# Altium schematic sheet FU6561N-XCQ-DEMO_V1.0-20251116.SCHDOC: ?
size A3; SheetNumber: 1; SheetTotal: 1; PageSetup: Record=PageOptions|CenterHorizontal=True|CenterVertical=True|PrintScale=0.81|XCorrection=1.00|YCorrection=1.00|PrintKind=0|BorderSize=5000000|LeftOffset=0|BottomOffset=0|Orientation=2|PaperLength=1000|PaperWidth=1000|Scale=100|PaperSource=7|PrintQuality=-4|MediaType=1|DitherType=10|PaperKind=A4|PrintScaleMode=1
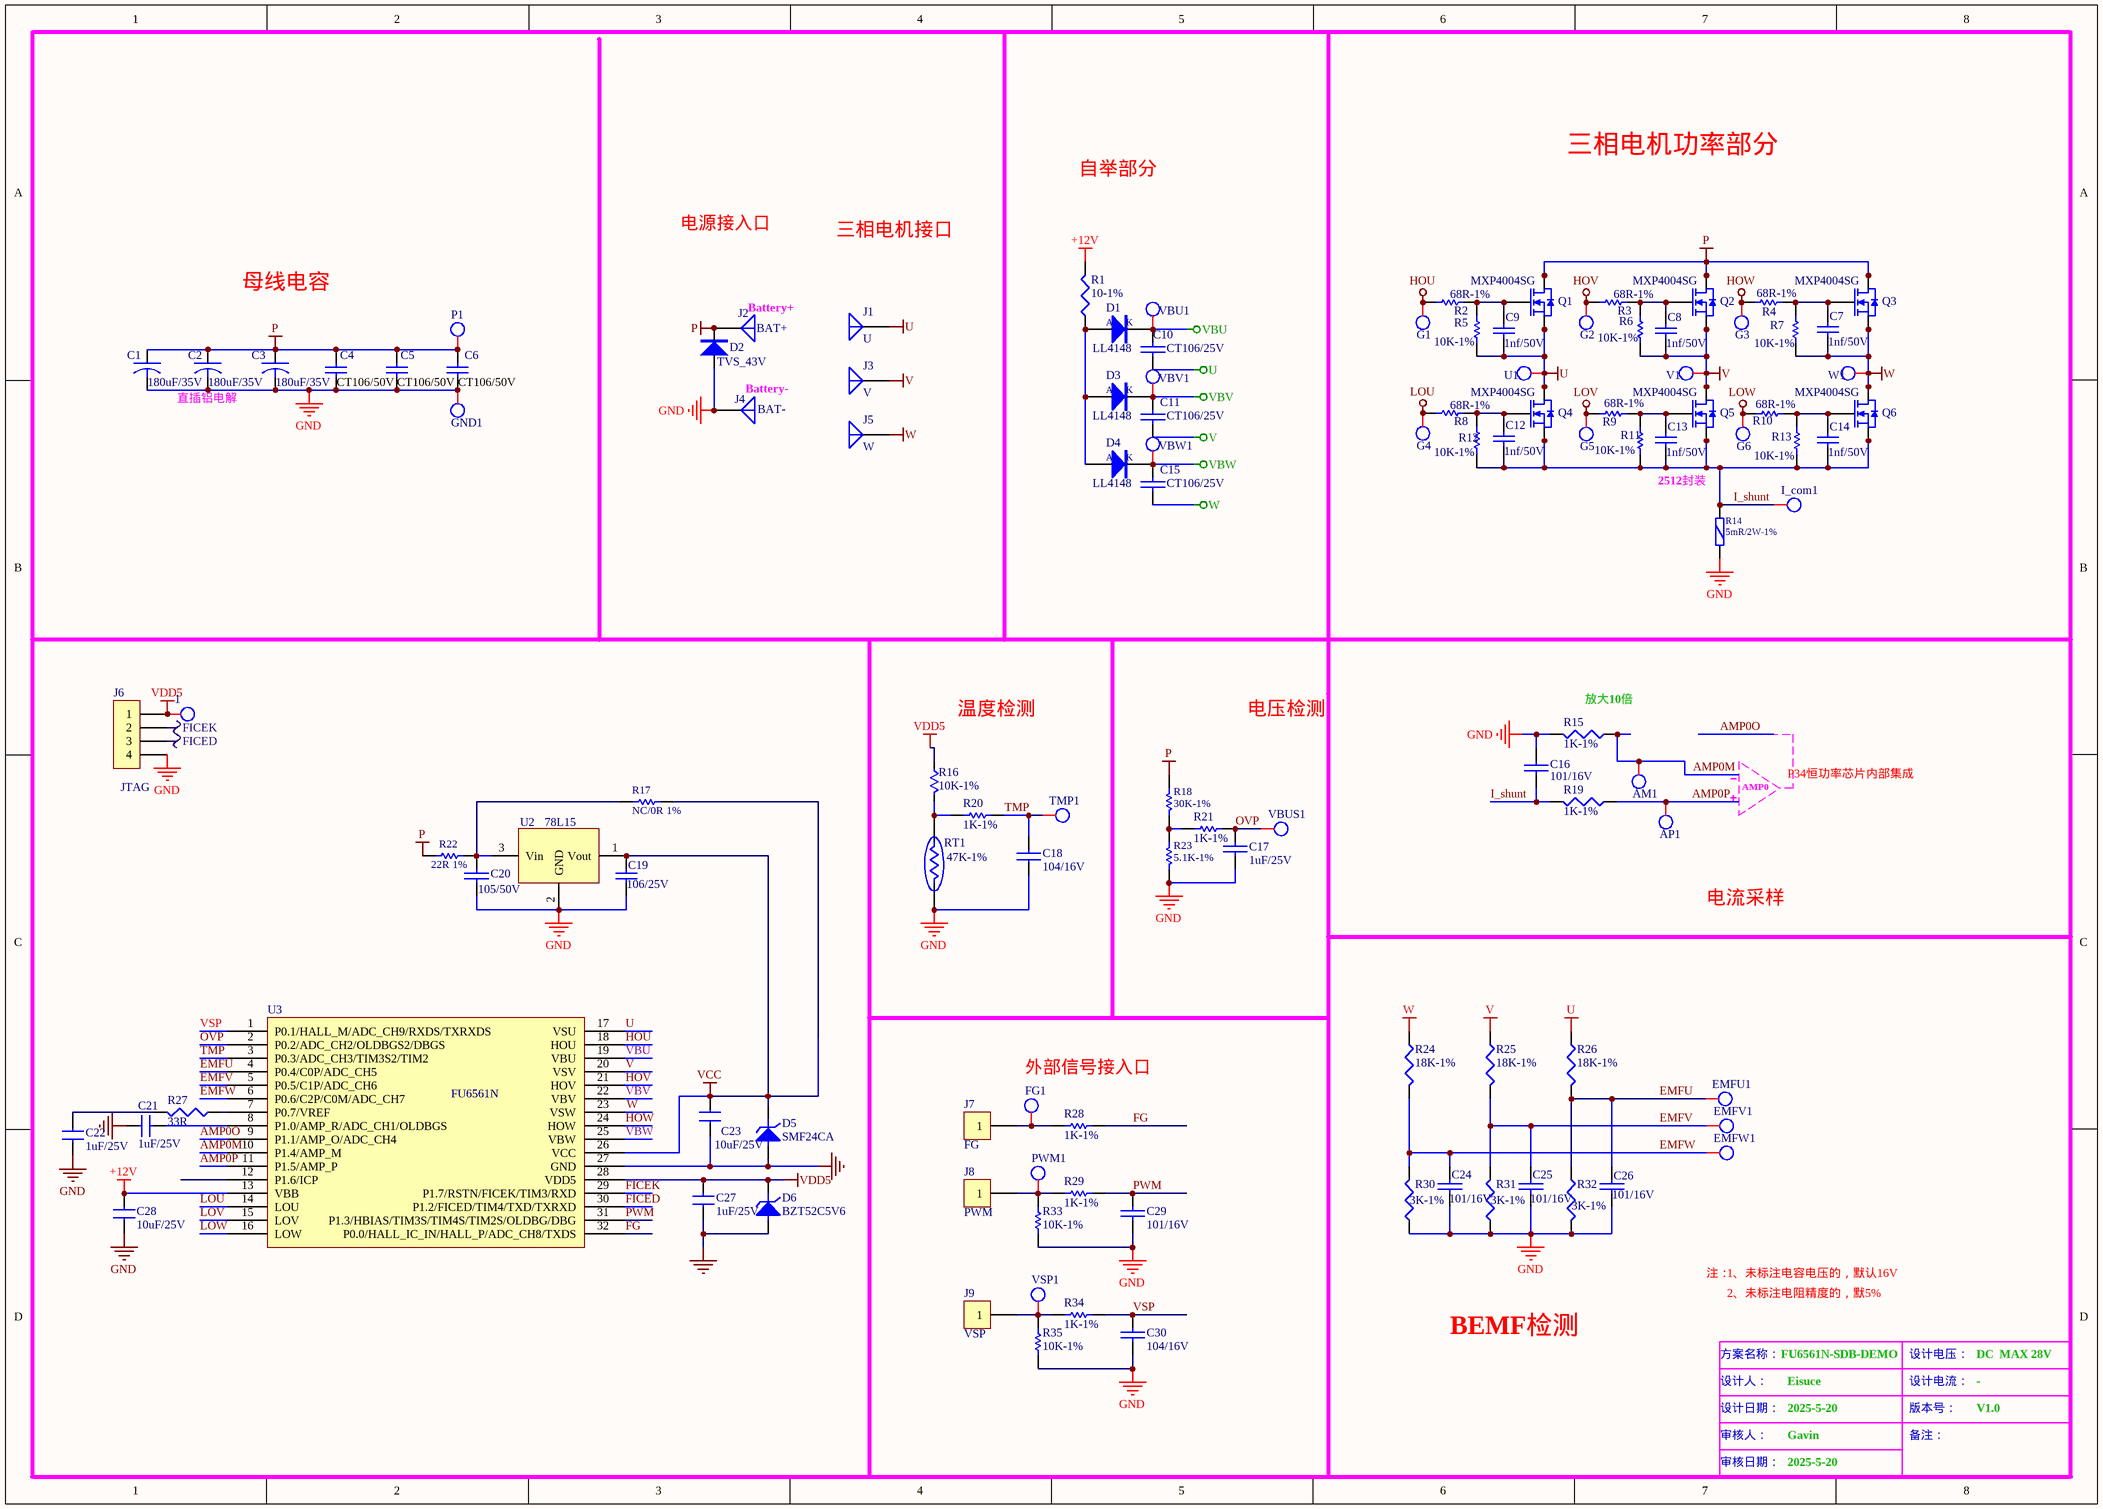
[diagram p0: FU6561N-XCQ-DEMO_V1.0-20251116.SCHDOC]

## Parts
1  (no value)  [TPM]
AM1  (no value)  [TPM]
AP1  (no value)  [TPM]
C1  180uF/35V  [CAP2_5]
C2  180uF/35V  [CAP2_5]
C3  180uF/35V  [CAP2_5]
C4  CT106/50V  [c1206]
C5  CT106/50V  [c1206]
C6  CT106/50V  [c1206]
C7  1nf/50V  [c0603]
C8  1nf/50V  [C0603]
C9  1nf/50V  [C0603]
C10  CT106/25V  [c0805]
C11  CT106/25V  [c0805]
C12  1nf/50V  [c0603]
C13  1nf/50V  [C0603]
C14  1nf/50V  [C0603]
C15  CT106/25V  [c0805]
C16  101/16V  [c0603]
C17  1uF/25V  [c0603]
C18  104/16V  [c0603]
C19  106/25V  [C0805]
C20  105/50V  [c1206]
C21  1uF/25V  [C0603]
C22  1uF/25V  [C0603]
C23  10uF/25V  [C0603]
C24  101/16V  [c0603]
C25  101/16V  [c0603]
C26  101/16V  [c0603]
C27  1uF/25V  [C0603]
C28  10uF/25V  [C0603]
C29  101/16V  [c0603]
C30  104/16V  [c0603]
D1  LL4148  [SOD-123]
D2  TVS_43V  [DO214AA, SMB]
D3  LL4148  [SOD-123]
D4  LL4148  [SOD-123]
D5  SMF24CA  [SOD-123]
D6  BZT52C5V6  [SOD-123]
EMFU1  (no value)  [TPM]
EMFV1  (no value)  [TPM]
EMFW1  (no value)  [TPM]
FG1  (no value)  [TPM]
G1  (no value)  [TPM]
G2  (no value)  [TPM]
G3  (no value)  [TPM]
G4  (no value)  [TPM]
G5  (no value)  [TPM]
G6  (no value)  [TPM]
GND1  (no value)  [TPM]
I_com1  (no value)  [TPM]
J1  U  [AD]
J2  BAT+  [DY]
J3  V  [AD]
J4  BAT-  [DY]
J5  W  [AD]
J6  JTAG  [SIP4-2]
J7  FG  [tp]
J8  PWM  [tp]
J9  VSP  [tp]
P1  (no value)  [TPM]
PWM1  (no value)  [TPM]
Q1  MXP4004SG  [PQFQ5X6]
Q2  MXP4004SG  [PQFQ5X6]
Q3  MXP4004SG  [PQFQ5X6]
Q4  MXP4004SG  [PQFQ5X6]
Q5  MXP4004SG  [PQFQ5X6]
Q6  MXP4004SG  [PQFQ5X6]
R1  10-1%  [r1206]
R2  68R-1%  [r0603]
R3  68R-1%  [r0603]
R4  68R-1%  [r0603]
R5  10K-1%  [r0603]
R6  10K-1%  [r0603]
R7  10K-1%  [r0603]
R8  68R-1%  [r0603]
R9  68R-1%  [r0603]
R10  68R-1%  [r0603]
R11  10K-1%  [r0603]
R12  10K-1%  [r0603]
R13  10K-1%  [r0603]
R14  5mR/2W-1%  [r2512]
R15  1K-1%  [r0603]
R16  10K-1%  [r0603]
R17  NC/0R 1%  [R1206]
R18  30K-1%  [r0603]
R19  1K-1%  [r0603]
R20  1K-1%  [r0603]
R21  1K-1%  [r0603]
R22  22R 1%  [R1206]
R23  5.1K-1%  [r0603]
R24  18K-1%  [r0603]
R25  18K-1%  [r0603]
R26  18K-1%  [r0603]
R27  33R  [R0603]
R28  1K-1%  [r0603]
R29  1K-1%  [r0603]
R30  3K-1%  [r0603]
R31  3K-1%  [r0603]
R32  3K-1%  [r0603]
R33  10K-1%  [r0603]
R34  1K-1%  [r0603]
R35  10K-1%  [r0603]
RT1  47K-1%  [r0603]
TMP1  (no value)  [TPM]
U1  (no value)  [TPM]
U2  78L15  [SOT-89]
U3  FU6561N  [QFN32-0.4-4X4]
V1  (no value)  [TPM]
VBU1  (no value)  [TPM]
VBUS1  (no value)  [TPM]
VBV1  (no value)  [TPM]
VBW1  (no value)  [TPM]
VSP1  (no value)  [TPM]
W1  (no value)  [TPM]

## Nets
+12V: C28.1 R1.2 U3.13(VBB)
FICED: J6.3 U3.30(P1.2/FICED/TIM4/TXD/TXRXD)
FICEK: J6.2 U3.29(P1.7/RSTN/FICEK/TIM3/RXD)
GND: C1.2 C2.2 C3.2 C4.1 C5.1 C6.1 C16.1 C17.2 C18.1 C19.1 C20.2 C21.1 C22.1 C23.2 C24.2 C25.2 C26.1 C27.2 C28.2 C29.1 C30.1 D2.2 D5.1(A) D6.1(A) GND1.1 J4.1(GND) J6.4 R14.1 R15.2 R23.2 R30.1 R31.1 R32.2 R33.1 R35.1 RT1.2 U2.2(GND) U3.27(GND)
HOU: G1.1 R2.1 U3.18(HOU)
HOV: G2.1 R3.1 U3.21(HOV)
HOW: G3.1 R4.1 U3.24(HOW)
LOU: G4.1 R8.1 U3.14(LOU)
LOV: G5.1 R9.1 U3.15(LOV)
LOW: G6.1 R10.1 U3.16(LOW)
P: C1.1 C2.1 C3.1 C4.2 C5.2 C6.2 D2.1 J2.1(+42V) P1.1 Q1.5(D) Q1.6(D) Q1.7(D) Q1.8(D) Q2.5(D) Q2.6(D) Q2.7(D) Q2.8(D) Q3.5(D) Q3.6(D) Q3.7(D) Q3.8(D) R18.1 R22.1
U: C9.1 C10.1 J1.1(U) Q1.1(S) Q1.2(S) Q1.3(S) Q4.5(D) Q4.6(D) Q4.7(D) Q4.8(D) R5.1 R26.1 U1.1 U3.17(VSU)
V: C8.1 C11.1 J3.1(V) Q2.1(S) Q2.2(S) Q2.3(S) Q5.5(D) Q5.6(D) Q5.7(D) Q5.8(D) R6.1 R25.1 U3.20(VSV) V1.1
VBU: C10.2 D1.2 U3.19(VBU) VBU1.1
VBV: C11.2 D3.2 U3.22(VBV) VBV1.1
VBW: C15.2 D4.2 U3.25(VBW) VBW1.1
VCC: C19.2 C23.1 D5.2(K) R17.1 U2.1(Vout) U3.26(VCC)
VDD5: 1.1 C27.1 D6.2(K) J6.1 R16.1 U3.28(VDD5)
W: C7.1 C15.1 J5.1(W) Q3.1(S) Q3.2(S) Q3.3(S) Q6.5(D) Q6.6(D) Q6.7(D) Q6.8(D) R7.1 R24.1 U3.23(VSW) W1.1
AMP0M: AM1.1 R15.1 U3.10(P1.4/AMP_M)
AMP0O: U3.9(P1.1/AMP_O/ADC_CH4)
AMP0P: AP1.1 R19.1 U3.11(P1.5/AMP_P)
EMFU: C26.2 EMFU1.1 R26.2 R32.1 U3.4(P0.4/C0P/ADC_CH5)
EMFV: C25.1 EMFV1.1 R25.2 R31.2 U3.5(P0.5/C1P/ADC_CH6)
EMFW: C24.1 EMFW1.1 R24.2 R30.2 U3.6(P0.6/C2P/C0M/ADC_CH7)
FG: R28.2 U3.32(P0.0/HALL_IC_IN/HALL_P/ADC_CH8/TXDS)
I_shunt: C12.1 C13.1 C14.1 C16.2 I_com1.1 Q4.1(S) Q4.2(S) Q4.3(S) Q5.1(S) Q5.2(S) Q5.3(S) Q6.1(S) Q6.2(S) Q6.3(S) R11.1 R12.1 R13.1 R14.2 R19.2
OVP: C17.1 R21.2 U3.2(P0.2/ADC_CH2/OLDBGS2/DBGS) VBUS1.1
PWM: C29.2 R29.2 U3.31(P1.3/HBIAS/TIM3S/TIM4S/TIM2S/OLDBG/DBG)
TMP: C18.2 R20.2 TMP1.1 U3.3(P0.3/ADC_CH3/TIM3S2/TIM2)
VSP: C30.2 R34.2 U3.1(P0.1/HALL_M/ADC_CH9/RXDS/TXRXDS)
NetC7_2: C7.2 Q3.4(G) R4.2 R7.2
NetC8_2: C8.2 Q2.4(G) R3.2 R6.2
NetC9_2: C9.2 Q1.4(G) R2.2 R5.2
NetC12_2: C12.2 Q4.4(G) R8.2 R12.2
NetC13_2: C13.2 Q5.4(G) R9.2 R11.2
NetC14_2: C14.2 Q6.4(G) R10.2 R13.2
NetC20_1: C20.1 R17.2 R22.2 U2.3(Vin)
NetC21_2: C21.2 U3.8(P1.0/AMP_R/ADC_CH1/OLDBGS)
NetC22_2: C22.2 R27.2
NetD1_1: D1.1 D3.1 D4.1 R1.1
NetFG1_1: FG1.1 J7.1 R28.1
NetJ8_1: J8.1 PWM1.1 R29.1 R33.2
NetJ9_1: J9.1 R34.1 R35.2 VSP1.1
NetR16_2: R16.2 R20.1 RT1.1
NetR18_2: R18.2 R21.1 R23.1
NetR27_1: R27.1 U3.7(P0.7/VREF)

Not connected (* = marked no-connect by the designer): U3 12(P1.6/ICP)

## Notes on the sheet
- 自举部分
- 三相电机功率部分
- 电源接入口
- 三相电机接口
- 母线电容
- (near J2) Battery+
- (near C2) 直插铝电解
- (near J4) Battery-
- 2512封装
- (near R16) 温度检测
- 电压检测
- (near R15) 放大10倍
- AMP0
- 电流采样
- 外部信号接入口
- 注：
- 1、未标注电容电压的，默认16V
- 2、未标注电阻精度的，默5%
- BEMF检测
- 方案名称：
- 设计人：
- FU6561N-SDB-DEMO
- Eisuce
- 设计电压：
- 设计电流：
- DC  MAX 28V
- -
- 设计日期：
- 审核人：
- 2025-5-20
- Gavin
- 版本号：
- 备注：
- V1.0
- 审核日期：
- Labels drawn without touching a wire or pin: P34恒功率芯片内部集成
- (in symbol DIODE) A; K

## Library data of the parts
1 AM1 AP1 EMFU1 EMFV1 EMFW1 FG1 G1-G6 GND1 I_com1 P1 PWM1 TMP1 U1 V1 VBU1 VBUS1 VBV1 VBW1 VSP1 W1 = Component_1
C1-C3 = CAPACITOR
C4-C9 C12-C14 = Cap: YG-C1206K106-50V（10UF）-10%; Value: 1nF; Published: 8-Jun-2000; LatestRevisionDate: 17-Jul-2002; LatestRevisionNote: Re-released for DXP Platform.; Publisher: Altium Limited
C10 C11 C15 = CAP-CC(SMD): Capacitor
C16 C17 C20-C30 = CAP: Capacitor
C18 = CAP NP: Text Field1: 20; Text Field2: 10
C19 = Cap Semi: Capacitor (Semiconductor SIM Model); Value: 22uF/25V; Published: 8-Jun-2000; LatestRevisionDate: 29-May-2009; LatestRevisionNote: IPC-7351 Footprint Added.; PackageReference: C1206; Publisher: Altium Limited; PackageDescription: Chip Capacitor
D1 D3 D4 = DIODE
D2 = D1206
D5 D6 = TVS1: Zener Diode
J1-J5 = ANTENNA: Generic Antenna
J6 = CON4: Connector
J7-J9 = CON1: Connector
Q1-Q6 = MOSFET-N
R1 R15 R19 R24-R27 R30-R32 = RES(SMD)
R2-R4 R8-R10 R20 R21 R28 R29 R33-R35 = Res Semi: Semiconductor Resistor; Value: 100; Published: 8-Jun-2000; LatestRevisionDate: 17-Jul-2002; LatestRevisionNote: Re-released for DXP Platform.; PackageReference: AXIAL-0.5; Publisher: Altium Limited
R5-R7 R11-R13 = Res Semi: YG-R0603F2002(20KΩ)-1%; Value: 20K; Published: 8-Jun-2000; LatestRevisionDate: 17-Jul-2002; LatestRevisionNote: Re-released for DXP Platform.; PackageReference: AXIAL-0.5; Publisher: Altium Limited
R14 = R-RES/2
R16 = RES3
R17 R22 = res1: R0603F1001(1KΩ)-1%; Value: 1K; Published: 8-Jun-2000; Revision: July-2002: Re-released for DXP Platform.; Publisher: Altium Limited
R18 R23 = res1: Resistor; Value: 1K; Published: 8-Jun-2000; Revision: July-2002: Re-released for DXP Platform.; Publisher: Altium Limited
RT1 = Res Thermal: Thermistor; Published: 24-Mar-1999; LatestRevisionDate: 29-May-2009; LatestRevisionNote: IPC-7351 Footprint Added.; PackageVersion: Mar-2003; PackageReference: 6-0805; Publisher: Altium Limited; PackageDescription: Chip Resistor 0805 Case Size; Code_IPC: RESC2012
U2 = VOLTREG: 78M12